# EAGLE design working (EAGLE 9.6.2)
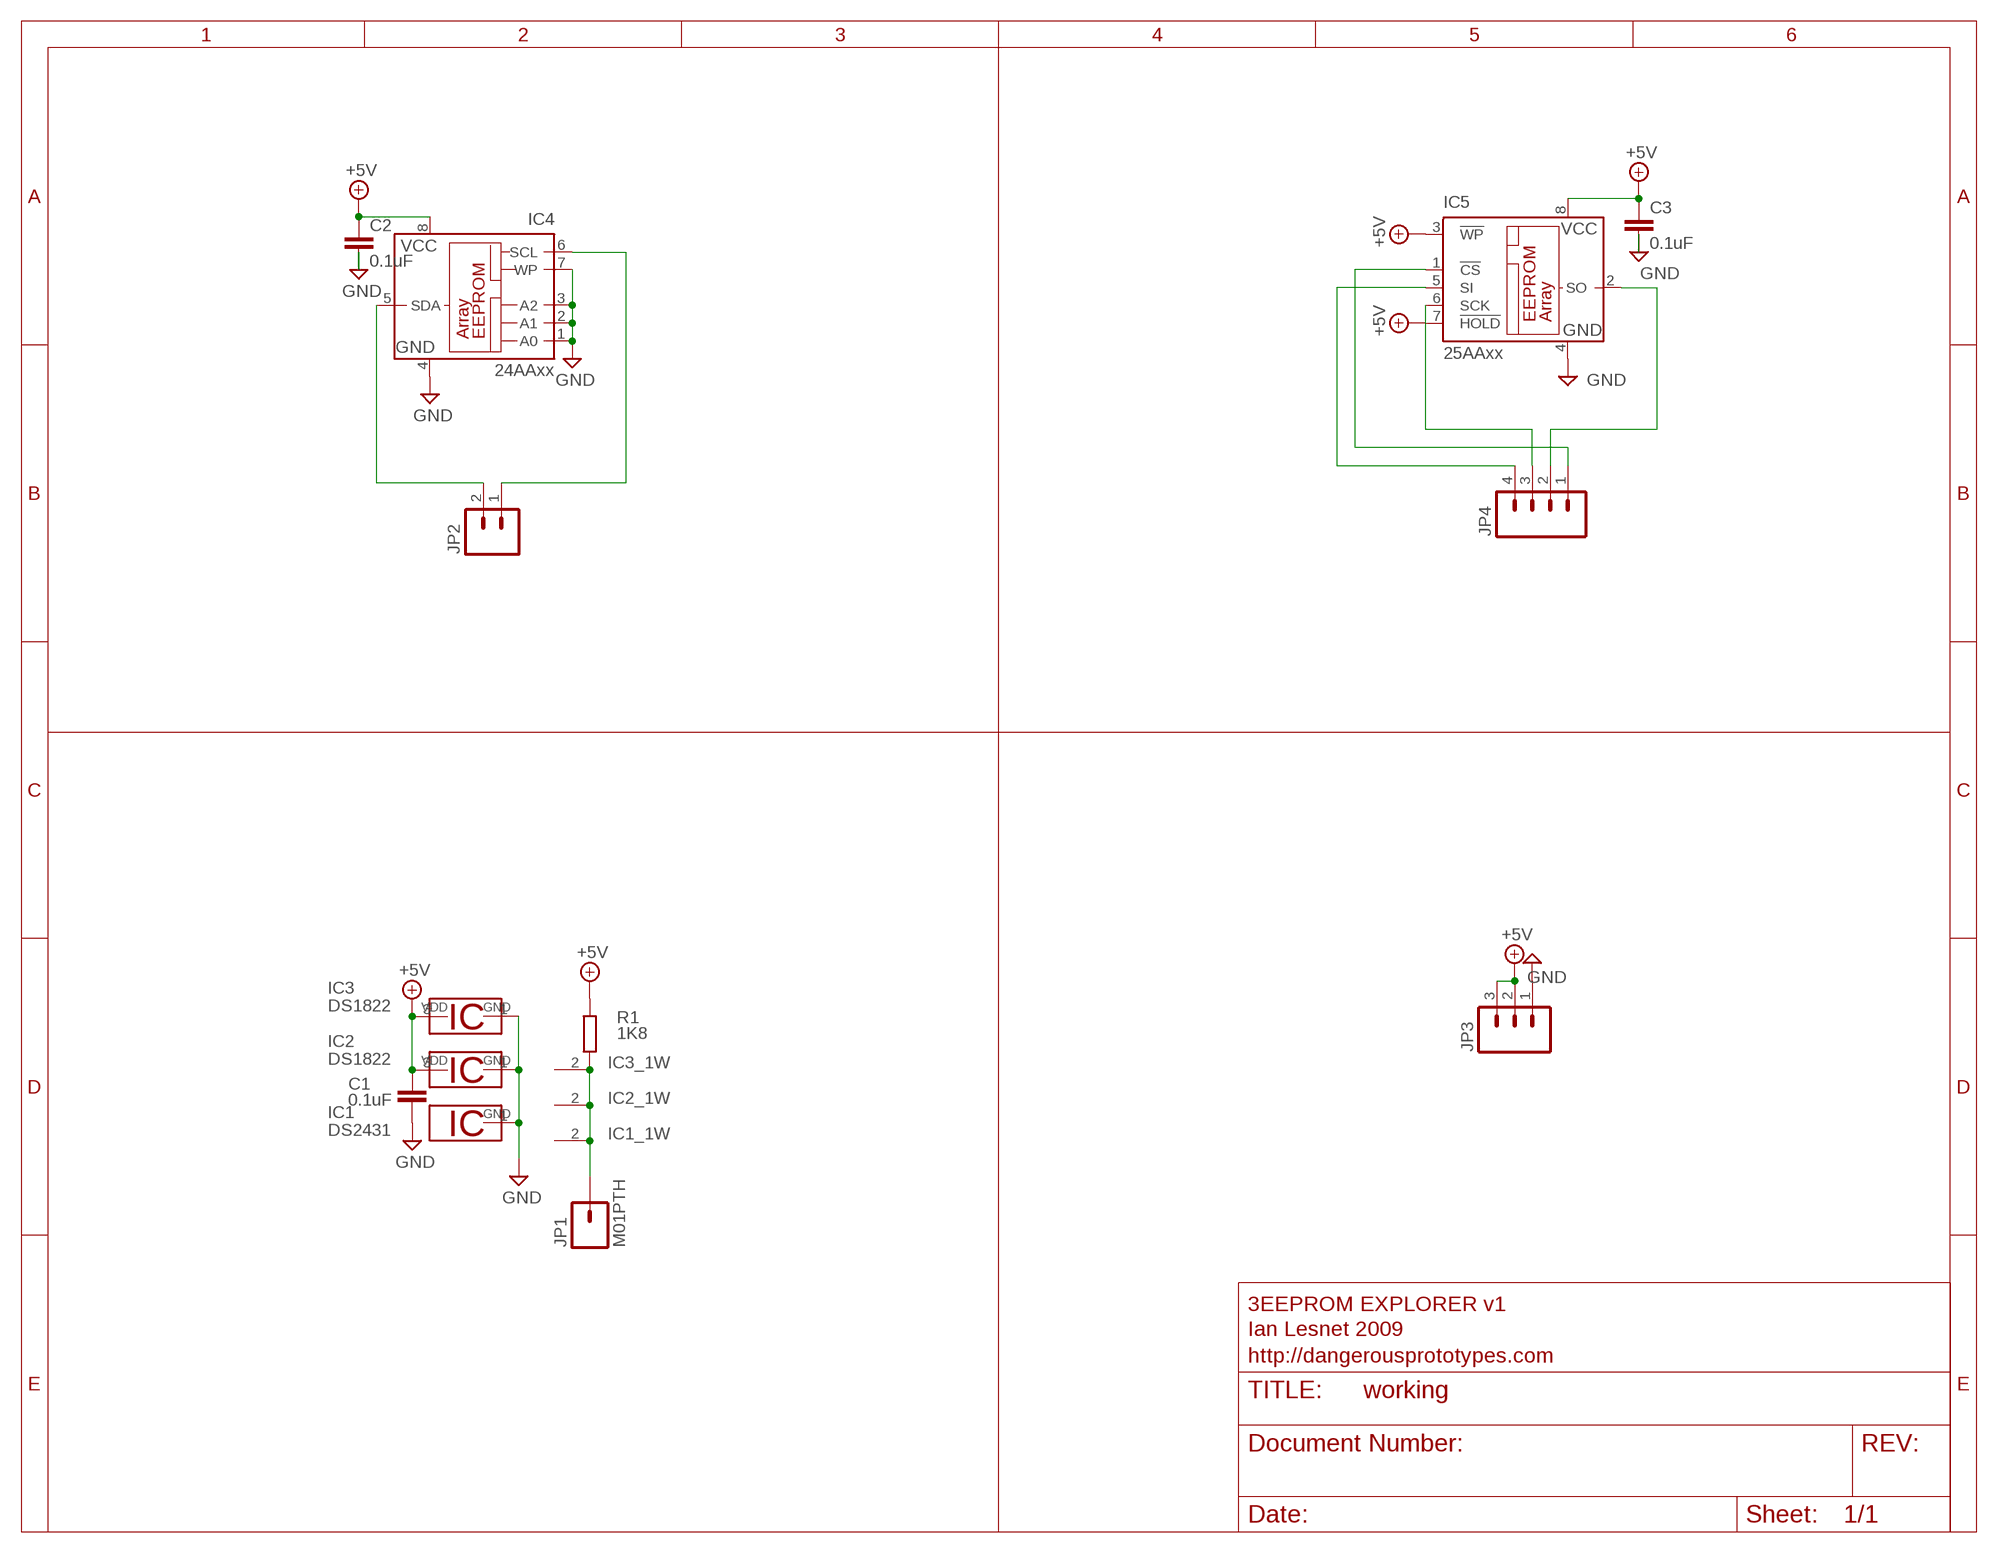
[diagram p0: schematic, sheet 1]

## Parts
C1  0.1uF  C-EU025-025X050  [C025-025X050]
C2  0.1uF  C-EU025-025X050  [C025-025X050]
C3  0.1uF  C-EU025-025X050  [C025-025X050]
IC1  DS2431  [TO92-]
IC2  DS1822  DS18S20  [TO92-]
IC3  DS1822  DS18S20  [TO92-]
IC4  24AAxx  24AA01P  [DIL8]
IC5  25AAxx  25AA040P  [DIL8]
JP1  M01PTH  [1X01]
JP2  M02PTH  [1X02]
JP3  M03PTH  [1X03]
JP4  M04PTH  [1X04]
R1  1K8  R-EU_0204/5  [0204/5]

## Nets
+5V: C1.1 C2.1 C3.1 IC2.3 IC3.3 IC4.8(VCC) IC5.3(!WP) IC5.7(!HOLD) IC5.8(VCC) JP3.2 JP3.3 R1.2
GND: C1.2 C2.2 C3.2 IC1.1(GND) IC2.1 IC3.1 IC4.1(A0) IC4.2(A1) IC4.3(A2) IC4.4(GND) IC4.7(WP) IC5.4(GND) JP3.1
N$1: IC5.1(!CS) JP4.1
N$2: IC5.2(SO) JP4.2
N$3: IC4.6(SCL) JP2.1
N$4: IC4.5(SDA) JP2.2
N$5: IC5.5(SI) JP4.4
N$6: IC5.6(SCK) JP4.3
N$11: IC1.2(1W) IC2.2 IC3.2 JP1.1 R1.1

## Notes on the sheet
- 3EEPROM EXPLORER v1
- Ian Lesnet 2009
- http://dangerousprototypes.com

## Library data of the parts
C1-C3 = rcl:C-EU: CAPACITOR, European symbol
IC1 = 1wire:DS2431: 1024-Bit EEPROM This chip provides a 4x256 Bit EEPROM, which can be programmed@5V. Write protection and OTP emulation are available, too. Author: Jan Kandziora <jjj@gmx.de>
IC2 IC3 = 1wire:DS18S20: High Precision Digital Thermometer This chip provides a onewire thermosensor with approx. 0.5°C accuracy.A programmable over/undertemperure alarm is available. Notes: Vdd must be applied for accurate measurements at low temperatures, as the parasite power circuit otherwise heats the sensor. If parasite power is used, Vdd has to be connected to GND. The DS1822 is a low-cost thermometer chip, the DS18B20 is similar to the DS18S20, but with 9..12 Bit programmable precision. Author: Jan Kandziora <jjj@gmx.de>
IC4 = microchip:24*: Serial EEPROM I2C
IC5 = microchip:25*: Serial EEPROM 4 K, SPI bus
JP1 = SparkFun:M01: Header 1 Standard 1-pin 0.1" header. Use with straight break away headers (SKU : PRT-00116), right angle break away headers (PRT-00553), swiss pins (PRT-00743), machine pins (PRT-00117), and female headers (PRT-00115).
JP2 = SparkFun:M02: Header 2 Standard 2-pin 0.1" header. Use with straight break away headers (SKU : PRT-00116), right angle break away headers (PRT-00553), swiss pins (PRT-00743), machine pins (PRT-00117), and female headers (PRT-00115). Molex polarized connector foot print use with SKU : PRT-08233 with associated crimp pins and housings.
JP3 = SparkFun:M03: Header 3 Standard 3-pin 0.1" header. Use with straight break away headers (SKU : PRT-00116), right angle break away headers (PRT-00553), swiss pins (PRT-00743), machine pins (PRT-00117), and female headers (PRT-00115). Molex polarized connector foot print use with SKU : PRT-08232 with associated crimp pins and housings.
JP4 = SparkFun:M04: Header 4 Standard 4-pin 0.1" header. Use with straight break away headers (SKU : PRT-00116), right angle break away headers (PRT-00553), swiss pins (PRT-00743), machine pins (PRT-00117), and female headers (PRT-00115). Molex polarized connector foot print use with SKU : PRT-08231 with associated crimp pins and housings.
R1 = rcl:R-EU_: RESISTOR, European symbol

## Board
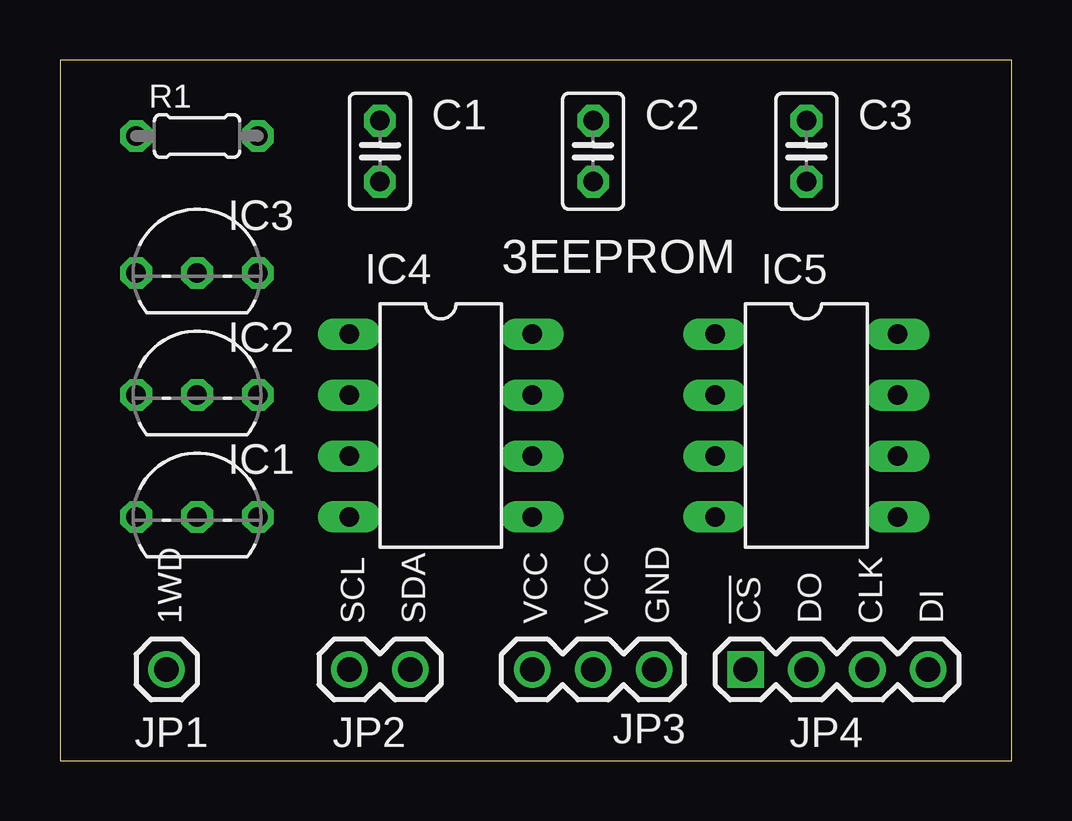
[diagram p1: board, top side]
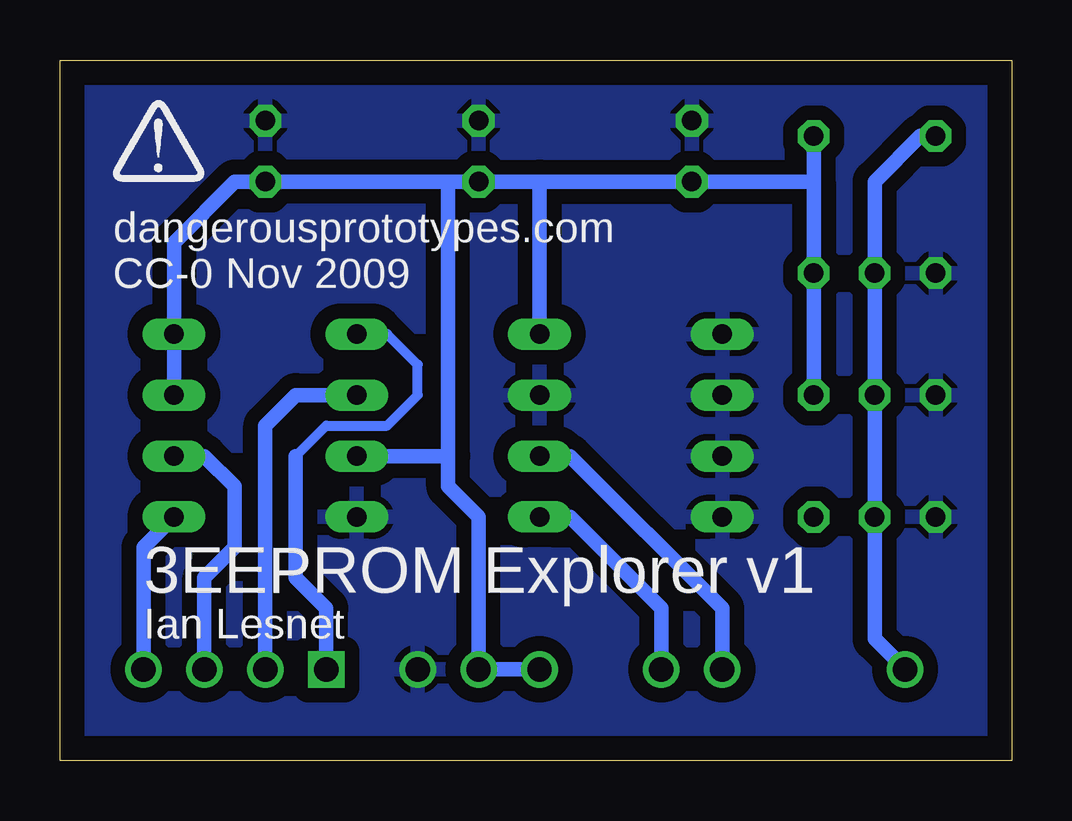
[diagram p2: board, bottom side, seen from below]

Size 39.67 x 29.2 mm. Coordinates in mm from the lower left corner, seen from the top.
Outline: 0,0 39.67,0 39.67,29.2 0,29.2 0,0
Copper layers (1*16): Top 0.035mm / dielectric 1.5mm / Bottom 0.035mm
Design rules "default": minimum track width 10mil, minimum drill 24mil, track to track 8mil, track to pad 8mil, pad to pad 8mil, via to via 8mil, smd to smd 8mil, copper to edge 40mil, drill to drill 8mil, minimum pad ring 10mil, minimum via ring 8mil, stop-mask expansion 4mil, vias tented up to drill 0mil, thermal gap 10mil

### Footprints (pad centres in the part's own frame; a part is rotated, then mirrored left to right if it is on the bottom)
C025-025X050 = drill 0.813 octagon: 1 -1.27,0; 2 1.27,0
TO92- = drill 0.813 octagon: 1 -2.54,0; 2 0,0; 3 2.54,0
DIL8 = drill 0.813 long: 1 -3.81,-3.81; 2 -1.27,-3.81; 3 1.27,-3.81; 4 3.81,-3.81; 5 3.81,3.81; 6 1.27,3.81; 7 -1.27,3.81; 8 -3.81,3.81
1X01 = drill 1.016: 1 0,0
1X02 = drill 1.016: 1 0,0; 2 2.54,0
1X03 = drill 1.016: 1 0,0; 2 2.54,0; 3 5.08,0
1X04 = drill 1.016 square: 1 0,0 | drill 1.016: 2 2.54,0; 3 5.08,0; 4 7.62,0
0204/5 = drill 0.813 octagon: 1 -2.54,0; 2 2.54,0

### Placement (x,y rotation side)
C1  13.33,25.4 90 top
C2  22.23,25.4 90 top
C3  31.12,25.4 90 top
IC1  5.71,10.16 0 top
IC2  5.71,15.24 0 top
IC3  5.71,20.32 0 top
IC4  15.88,13.97 270 top
IC5  31.12,13.97 270 top
JP1  4.45,3.81 0 top
JP2  12.06,3.81 0 top
JP3  24.77,3.81 180 top
JP4  28.58,3.81 0 top
R1  5.71,26.04 0 top
U$1  [DP-LOGO-BOTTOM]  33.66,24.13 0 top

### Tracks (layer width: path | path; a pad name or v marks a point on that pad's centre or on a via)
+5V
  Bottom 0.61: 8.26,24.13 IC3.3 IC2.3 | 19.69,24.13 C2.1 23.5,24.13 | 23.5,24.13 C3.1 32.38,24.13 34.92,21.59 IC5.8 | 23.5,12.7 23.5,24.13 | 23.5,12.7 IC5.3 | IC5.8 IC5.7 IC5.8 | 23.5,12.7 23.5,11.43 22.23,10.16 JP3.2 JP3.3 | 19.69,24.13 IC4.8 | 19.69,24.13 C1.1 8.26,24.13 | 8.26,24.13 R1.2
GND
  pour Bottom (isolate 0.61): 0.64,29.21 38.73,29.21 38.73,1.27 0.64,1.27
N$1
  Bottom 0.406: 29.85,12.7 28.58,13.97 26.04,13.97 24.77,15.24 24.77,16.51 26.04,17.78 IC5.1
  Bottom 0.61: JP4.1 28.58,6.35 29.85,7.62 29.85,12.7
N$2
  Bottom 0.61: IC5.2 29.85,15.24 31.12,13.97 JP4.2
N$3
  Bottom 0.61: IC4.6 18.42,12.7 12.06,6.35 JP2.1
N$4
  Bottom 0.61: IC4.5 18.42,10.16 14.61,6.35 JP2.2
N$5
  Bottom 0.61: IC5.5 36.2,8.89 JP4.4
N$6
  Bottom 0.61: IC5.6 33.66,12.7 32.38,11.43 32.38,8.89 33.66,7.62 JP4.3
N$10
  pour Bottom (isolate 0.61): 0.64,29.21 38.73,29.21 38.73,0 0.64,0
N$11
  Bottom 0.61: R1.1 3.81,26.04 5.71,24.13 IC3.2 IC2.2 IC1.2 5.71,5.08 JP1.1

### Text on the board
tNames: 3EEPROM | 1WD | SCL | SDA | VCC | VCC | GND | !CS | DO | CLK | DI
bNames: dangerousprototypes.com | CC-0 Nov 2009 | 3EEPROM Explorer v1 | Ian Lesnet
Document: SCL | SDA | GND | !CS | MISO | CLK | MOSI | 1Wire | +3-+5V | +3-+5V
Reference: 3EEPROM EXPLORER | CC-0 | Ian Lesnet 2009 | http://dangerousprototypes.com